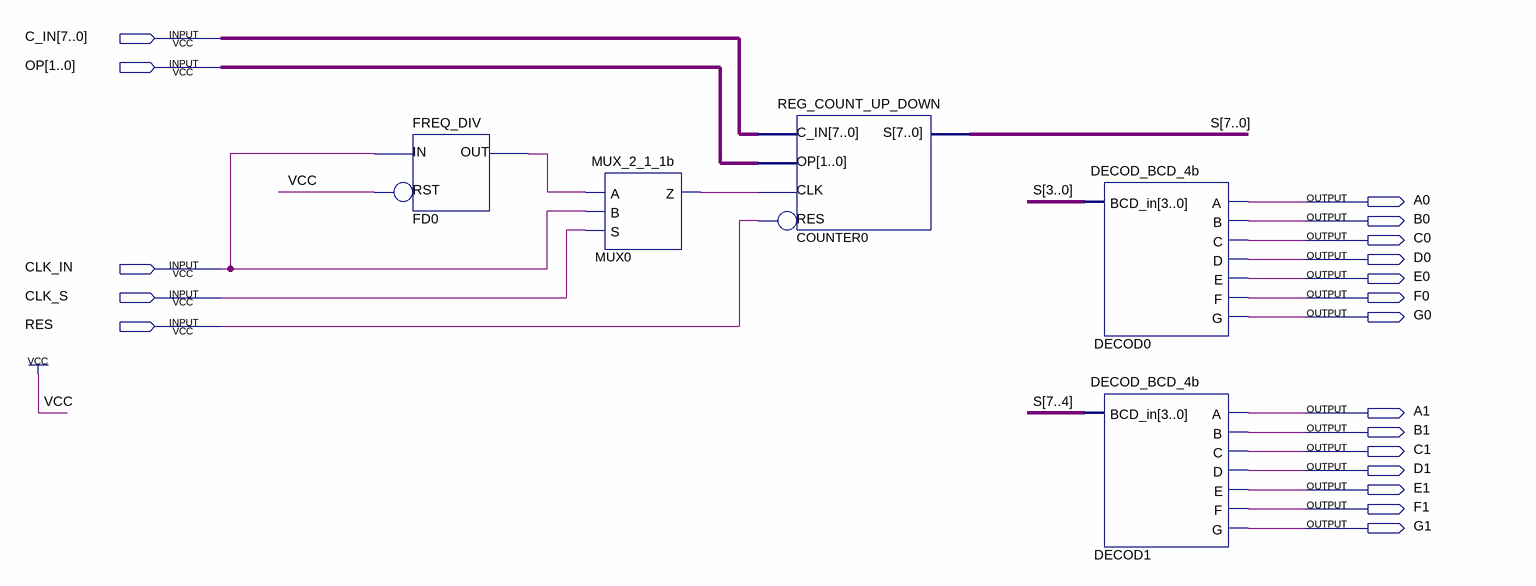
[diagram p0: schematic sheet]
// Quartus schematic CONT_UP_DOWN.bdf as structural Verilog: 5 symbols, 19 pins
module CONT_UP_DOWN (
  input  [7:0] C_IN,
  input  [1:0] OP,
  input  CLK_IN,
  input  CLK_S,
  input  RES,
  output A0,
  output B0,
  output C0,
  output D0,
  output E0,
  output F0,
  output G0,
  output A1,
  output B1,
  output C1,
  output D1,
  output E1,
  output F1,
  output G1
);

  wire FD0_out, MUX0_z;
  wire [7:0] S;

  FREQ_DIV FD0 (.IN(CLK_IN), .RST(1'b1), .OUT(FD0_out));
  MUX_2_1_1b MUX0 (.A(FD0_out), .B(CLK_IN), .S(CLK_S), .Z(MUX0_z));
  REG_COUNT_UP_DOWN COUNTER0 (.C_IN(C_IN), .OP(OP), .CLK(MUX0_z), .RES(RES), .S(S));
  DECOD_BCD_4b DECOD0 (.BCD_in(S[3:0]), .A(A0), .B(B0), .C(C0), .D(D0), .E(E0), .F(F0), .G(G0));
  DECOD_BCD_4b DECOD1 (.BCD_in(S[7:4]), .A(A1), .B(B1), .C(C1), .D(D1), .E(E1), .F(F1), .G(G1));
endmodule
